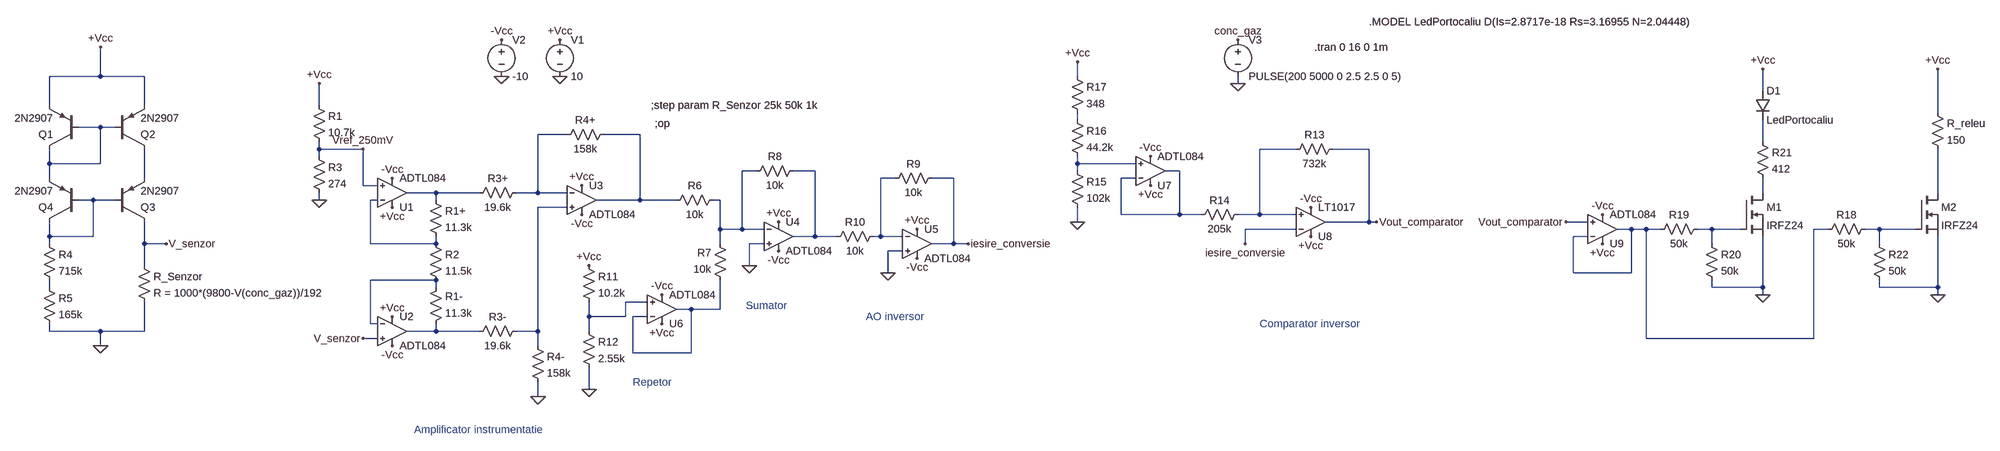
[diagram p0: schematic SCHEMA_FINALA.asc]
SCHEMA_FINALA.asc, the LTspice schematic file:
Version 4
SHEET 1 7264 820
WIRE -352 -496 -352 -560
WIRE -352 -496 -464 -496
WIRE -256 -496 -352 -496
WIRE 1792 -496 1792 -528
WIRE 2144 -480 2144 -496
WIRE 3296 -464 3296 -512
WIRE -464 -432 -464 -496
WIRE -256 -432 -256 -496
WIRE 128 -432 128 -480
WIRE 3680 -416 3680 -512
WIRE 1792 -400 1792 -416
WIRE -352 -384 -400 -384
WIRE -320 -384 -352 -384
WIRE 672 -368 608 -368
WIRE 832 -368 752 -368
WIRE 3296 -352 3296 -400
WIRE 128 -336 128 -352
WIRE 224 -336 128 -336
WIRE 2272 -336 2192 -336
WIRE 2432 -336 2352 -336
WIRE 128 -320 128 -336
WIRE -464 -304 -464 -336
WIRE -352 -304 -352 -384
WIRE -352 -304 -464 -304
WIRE 1792 -304 1792 -320
WIRE 1920 -304 1792 -304
WIRE 1088 -288 1056 -288
WIRE 1216 -288 1168 -288
WIRE 1792 -288 1792 -304
WIRE 2016 -288 1984 -288
WIRE -464 -272 -464 -304
WIRE -256 -272 -256 -336
WIRE 1392 -272 1360 -272
WIRE 1520 -272 1472 -272
WIRE 1920 -272 1888 -272
WIRE 224 -256 224 -336
WIRE 256 -256 224 -256
WIRE 384 -240 320 -240
WIRE 480 -240 384 -240
WIRE 608 -240 608 -368
WIRE 608 -240 560 -240
WIRE 672 -240 608 -240
WIRE 3296 -240 3296 -272
WIRE 3680 -240 3680 -336
WIRE -368 -224 -400 -224
WIRE -320 -224 -368 -224
WIRE 128 -224 128 -240
WIRE 256 -224 240 -224
WIRE 384 -224 384 -240
WIRE 832 -224 832 -368
WIRE 832 -224 736 -224
WIRE 912 -224 832 -224
WIRE 1008 -224 992 -224
WIRE 672 -208 608 -208
WIRE 1888 -192 1888 -272
WIRE 2016 -192 2016 -288
WIRE 2016 -192 1888 -192
WIRE 2064 -192 2016 -192
WIRE 2192 -192 2192 -336
WIRE 2192 -192 2144 -192
WIRE 2272 -192 2192 -192
WIRE 1792 -176 1792 -208
WIRE 2432 -176 2432 -336
WIRE 2432 -176 2336 -176
WIRE 2448 -176 2432 -176
WIRE 2912 -176 2864 -176
WIRE 1008 -160 1008 -224
WIRE 1056 -160 1056 -288
WIRE 1056 -160 1008 -160
WIRE 1104 -160 1056 -160
WIRE 2272 -160 2160 -160
WIRE 3008 -160 2976 -160
WIRE 3040 -160 3008 -160
WIRE 3072 -160 3040 -160
WIRE 3184 -160 3152 -160
WIRE 3248 -160 3184 -160
WIRE 3440 -160 3408 -160
WIRE 3552 -160 3520 -160
WIRE 3632 -160 3552 -160
WIRE -464 -144 -464 -176
WIRE -368 -144 -368 -224
WIRE -368 -144 -464 -144
WIRE 1216 -144 1216 -288
WIRE 1216 -144 1168 -144
WIRE 1264 -144 1216 -144
WIRE 1360 -144 1360 -272
WIRE 1360 -144 1344 -144
WIRE 1408 -144 1360 -144
WIRE 2912 -144 2880 -144
WIRE -464 -128 -464 -144
WIRE -256 -128 -256 -176
WIRE -208 -128 -256 -128
WIRE 240 -128 240 -224
WIRE 384 -128 384 -144
WIRE 384 -128 240 -128
WIRE 1008 -128 1008 -160
WIRE 1104 -128 1072 -128
WIRE 1520 -128 1520 -272
WIRE 1520 -128 1472 -128
WIRE 1552 -128 1520 -128
WIRE 2160 -128 2160 -160
WIRE 3184 -128 3184 -160
WIRE 3552 -128 3552 -160
WIRE 1408 -112 1376 -112
WIRE -256 -80 -256 -128
WIRE 1072 -80 1072 -128
WIRE 1376 -64 1376 -112
WIRE 2880 -64 2880 -144
WIRE 3008 -64 3008 -160
WIRE 3008 -64 2880 -64
WIRE 384 -48 240 -48
WIRE -464 -32 -464 -48
WIRE 384 -32 384 -48
WIRE 3184 -32 3184 -48
WIRE 3296 -32 3296 -144
WIRE 3296 -32 3184 -32
WIRE 3552 -32 3552 -48
WIRE 3680 -32 3680 -144
WIRE 3680 -32 3552 -32
WIRE 3296 -16 3296 -32
WIRE 3680 -16 3680 -32
WIRE 848 0 800 0
WIRE 944 16 912 16
WIRE 1008 16 1008 -48
WIRE 1008 16 944 16
WIRE 720 32 720 0
WIRE 800 32 800 0
WIRE 800 32 720 32
WIRE 848 32 816 32
WIRE 240 48 240 -48
WIRE 256 48 240 48
WIRE -464 64 -464 48
WIRE -352 64 -464 64
WIRE -256 64 -256 0
WIRE -256 64 -352 64
WIRE 384 64 384 48
WIRE 384 64 320 64
WIRE 480 64 384 64
WIRE 608 64 608 -208
WIRE 608 64 560 64
WIRE 720 64 720 32
WIRE 256 80 224 80
WIRE 3040 80 3040 -160
WIRE 3408 80 3408 -160
WIRE 3408 80 3040 80
WIRE -352 96 -352 64
WIRE 608 96 608 64
WIRE 816 112 816 32
WIRE 944 112 944 16
WIRE 944 112 816 112
WIRE 720 192 720 144
WIRE 608 208 608 176
FLAG -352 -560 +Vcc
FLAG 656 -496 0
FLAG 656 -576 +Vcc
FLAG -352 96 0
FLAG 528 -496 0
FLAG 528 -576 -Vcc
FLAG 288 -272 -Vcc
FLAG 288 -208 +Vcc
FLAG 288 96 -Vcc
FLAG 288 32 +Vcc
FLAG 608 208 0
FLAG 704 -192 -Vcc
FLAG 704 -256 +Vcc
FLAG 128 -224 0
FLAG 128 -480 +Vcc
FLAG 1136 -112 -Vcc
FLAG 1136 -176 +Vcc
FLAG 1072 -80 0
FLAG 1440 -96 -Vcc
FLAG 1440 -160 +Vcc
FLAG 1376 -64 0
FLAG 720 -80 +Vcc
FLAG 720 192 0
FLAG 880 -16 -Vcc
FLAG 880 48 +Vcc
FLAG 2304 -144 +Vcc
FLAG 2304 -208 -Vcc
FLAG 2144 -480 0
FLAG 2144 -576 conc_gaz
FLAG 1792 -176 0
FLAG 1792 -528 +Vcc
FLAG 1952 -320 -Vcc
FLAG 1952 -256 +Vcc
FLAG 3296 -16 0
FLAG 3296 -512 +Vcc
FLAG 2944 -192 -Vcc
FLAG 2944 -128 +Vcc
FLAG 2448 -176 Vout_comparator
FLAG 224 -336 Vref_250mV
FLAG -208 -128 V_senzor
FLAG 224 80 V_senzor
FLAG 1552 -128 iesire_conversie
FLAG 2160 -128 iesire_conversie
FLAG 3680 -16 0
FLAG 3680 -512 +Vcc
FLAG 2864 -176 Vout_comparator
SYMBOL voltage 656 -592 R0
WINDOW 123 0 0 Left 0
WINDOW 39 0 0 Left 0
SYMATTR InstName V1
SYMATTR Value 10
SYMBOL res -272 -96 R0
SYMATTR InstName R_Senzor
SYMATTR Value R = 1000*(9800-V(conc_gaz))/192
SYMBOL OpAmps\\ADTL084 288 -176 M180
SYMATTR InstName U1
SYMBOL voltage 528 -592 R0
WINDOW 123 0 0 Left 0
WINDOW 39 0 0 Left 0
SYMATTR InstName V2
SYMATTR Value -10
SYMBOL res 368 -240 R0
SYMATTR InstName R1+
SYMATTR Value 11.3k
SYMBOL res 368 -144 R0
SYMATTR InstName R2
SYMATTR Value 11.5k
SYMBOL OpAmps\\ADTL084 288 0 R0
SYMATTR InstName U2
SYMBOL res 368 64 M180
WINDOW 0 36 76 Left 2
WINDOW 3 36 40 Left 2
SYMATTR InstName R1-
SYMATTR Value 11.3k
SYMBOL res 576 -256 R90
WINDOW 0 0 56 VBottom 2
WINDOW 3 32 56 VTop 2
SYMATTR InstName R3+
SYMATTR Value 19.6k
SYMBOL res 576 48 R90
WINDOW 0 0 56 VBottom 2
WINDOW 3 32 56 VTop 2
SYMATTR InstName R3-
SYMATTR Value 19.6k
SYMBOL res 592 80 R0
SYMATTR InstName R4-
SYMATTR Value 158k
SYMBOL OpAmps\\ADTL084 704 -288 R0
SYMATTR InstName U3
SYMBOL res 768 -384 R90
WINDOW 0 0 56 VBottom 2
WINDOW 3 32 56 VTop 2
SYMATTR InstName R4+
SYMATTR Value 158k
SYMBOL pnp -400 -336 R180
SYMATTR InstName Q1
SYMATTR Value 2N2907
SYMBOL pnp -320 -336 M180
SYMATTR InstName Q2
SYMATTR Value 2N2907
SYMBOL pnp -320 -176 M180
SYMATTR InstName Q3
SYMATTR Value 2N2907
SYMBOL pnp -400 -176 R180
SYMATTR InstName Q4
SYMATTR Value 2N2907
SYMBOL res 112 -448 R0
SYMATTR InstName R1
SYMATTR Value 10.7k
SYMBOL res 112 -336 R0
SYMATTR InstName R3
SYMATTR Value 274
SYMBOL res -480 -144 R0
SYMATTR InstName R4
SYMATTR Value 715k
SYMBOL res -480 -48 R0
SYMATTR InstName R5
SYMATTR Value 165k
SYMBOL OpAmps\\ADTL084 1136 -208 R0
SYMATTR InstName U4
SYMBOL res 1008 -240 R90
WINDOW 0 0 56 VBottom 2
WINDOW 3 32 56 VTop 2
SYMATTR InstName R6
SYMATTR Value 10k
SYMBOL res 1024 -32 R180
WINDOW 0 36 76 Left 2
WINDOW 3 36 40 Left 2
SYMATTR InstName R7
SYMATTR Value 10k
SYMBOL res 1184 -304 R90
WINDOW 0 0 56 VBottom 2
WINDOW 3 32 56 VTop 2
SYMATTR InstName R8
SYMATTR Value 10k
SYMBOL OpAmps\\ADTL084 1440 -192 R0
SYMATTR InstName U5
SYMBOL res 1488 -288 R90
WINDOW 0 0 56 VBottom 2
WINDOW 3 32 56 VTop 2
SYMATTR InstName R9
SYMATTR Value 10k
SYMBOL res 1360 -160 R90
WINDOW 0 0 56 VBottom 2
WINDOW 3 32 56 VTop 2
SYMATTR InstName R10
SYMATTR Value 10k
SYMBOL res 704 -96 R0
SYMATTR InstName R11
SYMATTR Value 10.2k
SYMBOL res 704 48 R0
SYMATTR InstName R12
SYMATTR Value 2.55k
SYMBOL OpAmps\\ADTL084 880 80 M180
SYMATTR InstName U6
SYMBOL res 2368 -352 R90
WINDOW 0 0 56 VBottom 2
WINDOW 3 32 56 VTop 2
SYMATTR InstName R13
SYMATTR Value 732k
SYMBOL res 2160 -208 R90
WINDOW 0 0 56 VBottom 2
WINDOW 3 32 56 VTop 2
SYMATTR InstName R14
SYMATTR Value 205k
SYMBOL Comparators\\LT1017 2304 -176 M180
SYMATTR InstName U8
SYMBOL voltage 2144 -592 R0
WINDOW 123 0 0 Left 0
WINDOW 39 0 0 Left 0
SYMATTR InstName V3
SYMATTR Value PULSE(200 5000 0 2.5 2.5 0 5)
SYMBOL res 1776 -304 R0
SYMATTR InstName R15
SYMATTR Value 102k
SYMBOL res 1776 -416 R0
SYMATTR InstName R16
SYMATTR Value 44.2k
SYMBOL res 1776 -512 R0
SYMATTR InstName R17
SYMATTR Value 348
SYMBOL OpAmps\\ADTL084 1952 -224 M180
SYMATTR InstName U7
SYMBOL nmos 3248 -240 R0
SYMATTR InstName M1
SYMATTR Value IRFZ24
SYMBOL res 3168 -176 R90
WINDOW 0 0 56 VBottom 2
WINDOW 3 32 56 VTop 2
SYMATTR InstName R19
SYMATTR Value 50k
SYMBOL res 3168 -144 R0
SYMATTR InstName R20
SYMATTR Value 50k
SYMBOL diode 3280 -464 R0
SYMATTR InstName D1
SYMATTR Value LedPortocaliu
SYMBOL res 3280 -368 R0
SYMATTR InstName R21
SYMATTR Value 412
SYMBOL OpAmps\\ADTL084 2944 -96 M180
SYMATTR InstName U9
SYMBOL nmos 3632 -240 R0
SYMATTR InstName M2
SYMATTR Value IRFZ24
SYMBOL res 3536 -176 R90
WINDOW 0 0 56 VBottom 2
WINDOW 3 32 56 VTop 2
SYMATTR InstName R18
SYMATTR Value 50k
SYMBOL res 3536 -144 R0
SYMATTR InstName R22
SYMATTR Value 50k
SYMBOL res 3664 -432 R0
SYMATTR InstName R_releu
SYMATTR Value 150
TEXT 864 -392 Left 2 !;op
TEXT 856 -432 Left 2 !;step param R_Senzor 25k 50k 1k
TEXT 2432 -616 Left 2 !.MODEL LedPortocaliu D(Is=2.8717e-18 Rs=3.16955 N=2.04448)
TEXT 336 280 Left 2 ;Amplificator instrumentatie
TEXT 816 176 Left 2 ;Repetor
TEXT 1064 8 Left 2 ;Sumator
TEXT 1328 32 Left 2 ;AO inversor
TEXT 2192 48 Left 2 ;Comparator inversor
TEXT 2312 -560 Left 2 !.tran 0 16 0 1m

The netlist it stands for:
* SCHEMA_FINALA.asc
V1 +Vcc 0 10
R_Senzor V_senzor 0 R = 1000*(9800-V(conc_gaz))/192
XU1 Vref_250mV N017 +Vcc -Vcc N013 ADTL084  ; pins In+ In- V+ V- OUT
V2 -Vcc 0 -10
R1+ N013 N017 11.3k
R2 N017 N022 11.5k
XU2 V_senzor N022 +Vcc -Vcc N026 ADTL084  ; pins In+ In- V+ V- OUT
R1- N026 N022 11.3k
R3+ N003 N013 19.6k
R3- N018 N026 19.6k
R4- N018 0 158k
XU3 N018 N003 +Vcc -Vcc N004 ADTL084  ; pins In+ In- V+ V- OUT
R4+ N004 N003 158k
Q1 N002 N002 +Vcc 0 2N2907
Q2 N011 N002 +Vcc 0 2N2907
Q3 V_senzor N016 N011 0 2N2907
Q4 N016 N016 N002 0 2N2907
R1 +Vcc Vref_250mV 10.7k
R3 Vref_250mV 0 274
R4 N016 N023 715k
R5 N023 0 165k
XU4 0 N008 +Vcc -Vcc N009 ADTL084  ; pins In+ In- V+ V- OUT
R6 N008 N004 10k
R7 N025 N008 10k
R8 N009 N008 10k
XU5 0 N012 +Vcc -Vcc iesire_conversie ADTL084  ; pins In+ In- V+ V- OUT
R9 iesire_conversie N012 10k
R10 N012 N009 10k
R11 +Vcc N024 10.2k
R12 N024 0 2.55k
XU6 N024 N025 +Vcc -Vcc N025 ADTL084  ; pins In+ In- V+ V- OUT
R13 Vout_comparator N006 732k
R14 N006 N010 205k
XU8 N006 iesire_conversie +Vcc -Vcc Vout_comparator LT1017  ; pins In+ In- V+ V- OUT
V3 conc_gaz 0 PULSE(200 5000 0 2.5 2.5 0 5)
R15 N007 0 102k
R16 N001 N007 44.2k
R17 +Vcc N001 348
XU7 N007 N010 +Vcc -Vcc N010 ADTL084  ; pins In+ In- V+ V- OUT
M1 N014 N020 0 0 IRFZ24
R19 N020 N019 50k
R20 N020 0 50k
D1 +Vcc N005 LedPortocaliu
R21 N005 N014 412
XU9 Vout_comparator N019 +Vcc -Vcc N019 ADTL084  ; pins In+ In- V+ V- OUT
M2 N015 N021 0 0 IRFZ24
R18 N021 N019 50k
R22 N021 0 50k
R_releu +Vcc N015 150
.model D D
.lib standard.dio
.model NPN NPN
.model PNP PNP
.lib standard.bjt
.model NMOS NMOS
.model PMOS PMOS
.lib standard.mos
;op
;step param R_Senzor 25k 50k 1k
.MODEL LedPortocaliu D(Is=2.8717e-18 Rs=3.16955 N=2.04448)
* Amplificator instrumentatie
* Repetor
* Sumator
* AO inversor
* Comparator inversor
.tran 0 16 0 1m
.lib ADTL084.lib
.backanno
.end